# Altium project zaWRka_Project.PrjPcb
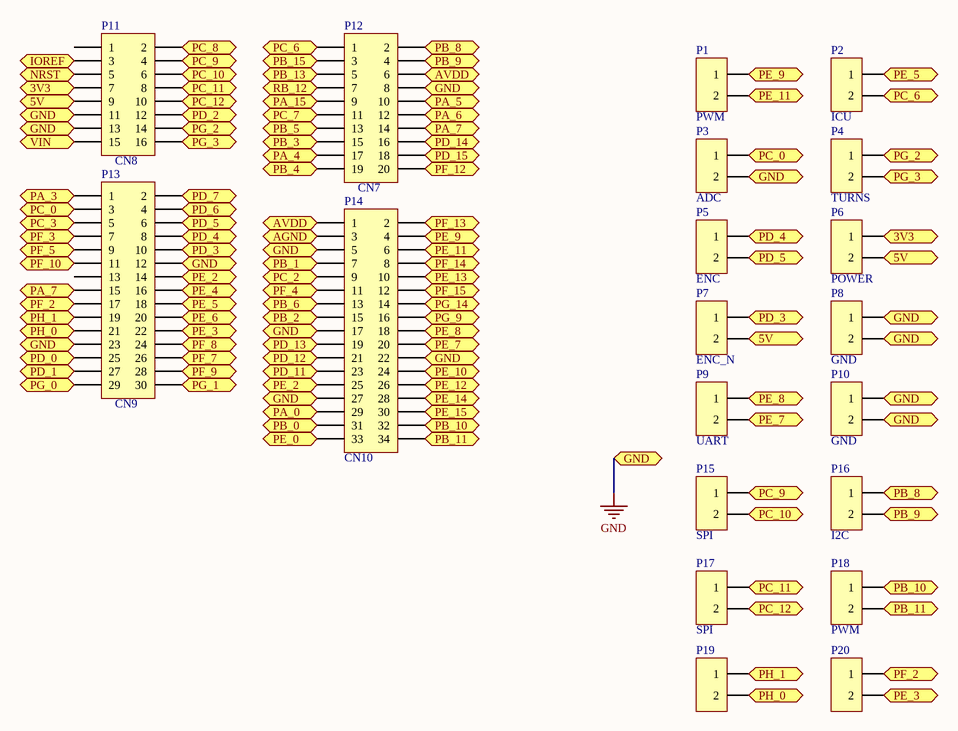
[diagram p0: cross_STM.SchDoc]
1 sheet, 20 parts. Net scope: flat (ports and power ports of the same name join across sheets).
Board file: cross_stm_PCB.PcbDoc

## Sheet cross_STM.SchDoc
size A4

### Parts
P1  PWM  [DG308-2.54-02P]
P2  ICU  [DG308-2.54-02P]
P3  ADC  [DG308-2.54-02P]
P4  TURNS  [DG308-2.54-02P]
P5  ENC  [DG308-2.54-02P]
P6  POWER  [DG308-2.54-02P]
P7  ENC_N  [DG308-2.54-02P]
P8  GND  [DG308-2.54-02P]
P9  UART  [DG308-2.54-02P]
P10  GND  [DG308-2.54-02P]
P11  CN8  [HDR2X8]
P12  CN7  [HDR2X10]
P13  CN9  [HDR2X15]
P14  CN10  [HDR2X17]
P15  SPI  [DG308-2.54-02P]
P16  I2C  [DG308-2.54-02P]
P17  SPI  [DG308-2.54-02P]
P18  PWM  [DG308-2.54-02P]
P19  DG308-2.54-02P  [DG308-2.54-02P]  (value not drawn)
P20  DG308-2.54-02P  [DG308-2.54-02P]  (value not drawn)

### Ports
3V3, 5V, AGND, AVDD, GND, IOREF, NRST, PA_0, PA_3, PA_4, PA_5, PA_6, PA_7, PA_15, PB_0, PB_1, PB_2, PB_3, PB_4, PB_5, PB_6, PB_8, PB_9, PB_10, PB_11, PB_13, PB_15, PC_0, PC_2, PC_3, PC_6, PC_7, PC_8, PC_9, PC_10, PC_11, PC_12, PD_0, PD_1, PD_2, PD_3, PD_4, PD_5, PD_6, PD_7, PD_11, PD_12, PD_13, PD_14, PD_15, PE_0, PE_2, PE_3, PE_4, PE_5, PE_6, PE_7, PE_8, PE_9, PE_10, PE_11, PE_12, PE_13, PE_14, PE_15, PF_2, PF_3, PF_4, PF_5, PF_7, PF_8, PF_9, PF_10, PF_12, PF_13, PF_14, PF_15, PG_0, PG_1, PG_2, PG_3, PG_9, PG_14, PH_0, PH_1, RB_12, VIN

### Nets
GND: P3.2 P8.1 P8.2 P10.1 P10.2 P11.11 P11.13 P12.8 P13.12 P13.23 P14.5 P14.17 P14.22 P14.27 ; port GND
NetP1_1: P1.1 P14.4 ; port PE_9
NetP1_2: P1.2 P14.6 ; port PE_11
NetP2_1: P2.1 P13.18 ; port PE_5
NetP2_2: P2.2 P12.1 ; port PC_6
NetP3_1: P3.1 P13.3 ; port PC_0
NetP4_1: P4.1 P11.14 ; port PG_2
NetP4_2: P4.2 P11.16 ; port PG_3
NetP5_1: P5.1 P13.8 ; port PD_4
NetP5_2: P5.2 P13.6 ; port PD_5
NetP6_1: P6.1 P11.7 ; port 3V3
NetP6_2: P6.2 P7.2 P11.9 ; port 5V
NetP7_1: P7.1 P13.10 ; port PD_3
NetP9_1: P9.1 P14.18 ; port PE_8
NetP9_2: P9.2 P14.20 ; port PE_7
NetP11_2: P11.2 ; port PC_8
NetP11_3: P11.3 ; port IOREF
NetP11_4: P11.4 P15.1 ; port PC_9
NetP11_5: P11.5 ; port NRST
NetP11_6: P11.6 P15.2 ; port PC_10
NetP11_8: P11.8 P17.1 ; port PC_11
NetP11_10: P11.10 P17.2 ; port PC_12
NetP11_12: P11.12 ; port PD_2
NetP11_15: P11.15 ; port VIN
NetP12_2: P12.2 P16.1 ; port PB_8
NetP12_3: P12.3 ; port PB_15
NetP12_4: P12.4 P16.2 ; port PB_9
NetP12_5: P12.5 ; port PB_13
NetP12_6: P12.6 P14.1 ; port AVDD
NetP12_7: P12.7 ; port RB_12
NetP12_9: P12.9 ; port PA_15
NetP12_10: P12.10 ; port PA_5
NetP12_11: P12.11 ; port PC_7
NetP12_12: P12.12 ; port PA_6
NetP12_13: P12.13 ; port PB_5
NetP12_14: P12.14 P13.15 ; port PA_7
NetP12_15: P12.15 ; port PB_3
NetP12_16: P12.16 ; port PD_14
NetP12_17: P12.17 ; port PA_4
NetP12_18: P12.18 ; port PD_15
NetP12_19: P12.19 ; port PB_4
NetP12_20: P12.20 ; port PF_12
NetP13_1: P13.1 ; port PA_3
NetP13_2: P13.2 ; port PD_7
NetP13_4: P13.4 ; port PD_6
NetP13_5: P13.5 ; port PC_3
NetP13_7: P13.7 ; port PF_3
NetP13_9: P13.9 ; port PF_5
NetP13_11: P13.11 ; port PF_10
NetP13_14: P13.14 P14.25 ; port PE_2
NetP13_16: P13.16 ; port PE_4
NetP13_17: P13.17 P20.1 ; port PF_2
NetP13_19: P13.19 P19.1 ; port PH_1
NetP13_20: P13.20 ; port PE_6
NetP13_21: P13.21 P19.2 ; port PH_0
NetP13_22: P13.22 P20.2 ; port PE_3
NetP13_24: P13.24 ; port PF_8
NetP13_25: P13.25 ; port PD_0
NetP13_26: P13.26 ; port PF_7
NetP13_27: P13.27 ; port PD_1
NetP13_28: P13.28 ; port PF_9
NetP13_29: P13.29 ; port PG_0
NetP13_30: P13.30 ; port PG_1
NetP14_2: P14.2 ; port PF_13
NetP14_3: P14.3 ; port AGND
NetP14_7: P14.7 ; port PB_1
NetP14_8: P14.8 ; port PF_14
NetP14_9: P14.9 ; port PC_2
NetP14_10: P14.10 ; port PE_13
NetP14_11: P14.11 ; port PF_4
NetP14_12: P14.12 ; port PF_15
NetP14_13: P14.13 ; port PB_6
NetP14_14: P14.14 ; port PG_14
NetP14_15: P14.15 ; port PB_2
NetP14_16: P14.16 ; port PG_9
NetP14_19: P14.19 ; port PD_13
NetP14_21: P14.21 ; port PD_12
NetP14_23: P14.23 ; port PD_11
NetP14_24: P14.24 ; port PE_10
NetP14_26: P14.26 ; port PE_12
NetP14_28: P14.28 ; port PE_14
NetP14_29: P14.29 ; port PA_0
NetP14_30: P14.30 ; port PE_15
NetP14_31: P14.31 ; port PB_0
NetP14_32: P14.32 P18.1 ; port PB_10
NetP14_33: P14.33 ; port PE_0
NetP14_34: P14.34 P18.2 ; port PB_11

Not connected (* = marked no-connect by the designer): P11 1; P13 13

### Library data of the parts
P1-P10 P15-P18 = DG308-2.54-02P
P11 = Header 8X2: Header, 8-Pin, Dual row; LatestRevisionDate: 17-Jul-2002; LatestRevisionNote: Re-released for DXP Platform.; Publisher: Altium Limited
P12 = Header 10X2: Header, 10-Pin, Dual row; LatestRevisionDate: 17-Jul-2002; LatestRevisionNote: Re-released for DXP Platform.; Publisher: Altium Limited
P13 = Header 15X2: Header, 15-Pin, Dual row; LatestRevisionDate: 17-Jul-2002; LatestRevisionNote: Re-released for DXP Platform.; Publisher: Altium Limited
P14 = Header 17X2: Header, 17-Pin, Dual row; LatestRevisionDate: 17-Jul-2002; LatestRevisionNote: Re-released for DXP Platform.; Publisher: Altium Limited